# EAGLE design ExtensionV1 (EAGLE 6.1)
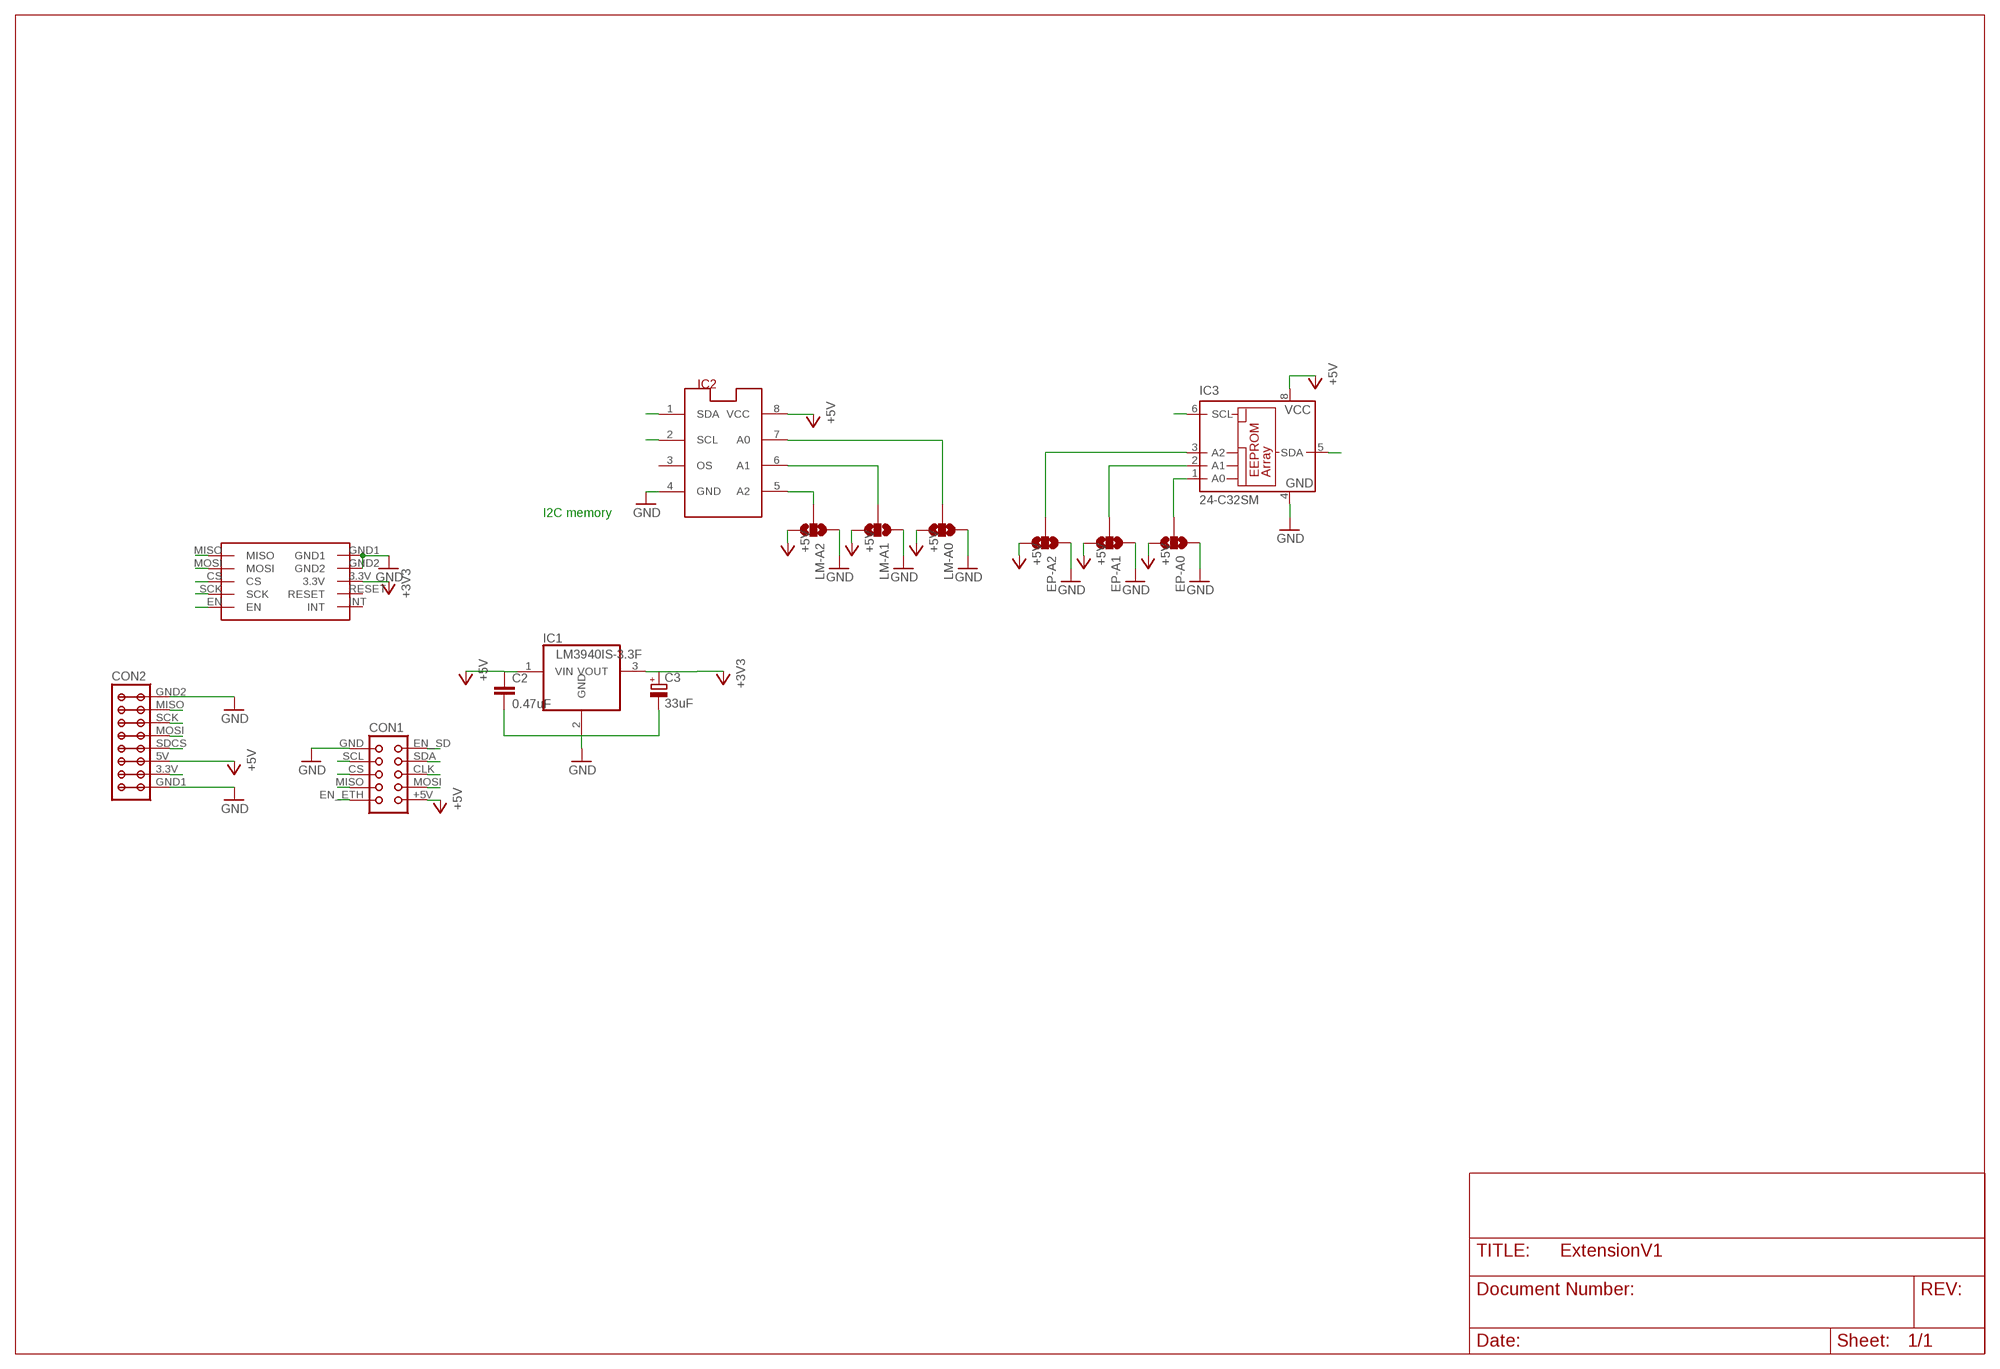
[diagram p0: schematic, sheet 1]

## Parts
C2  0.47uF  C-EUC1206  [C1206]
C3  33uF  CPOL-EUE3.5-8  [E3,5-8]
CON1  CON10EXT  [CON10EXT]
CON2  SD-CARD-EXTENSION  [SD-CARD]
EP-A0  SOLDERJUMPER_2WAY  [1206-SWITCH]
EP-A1  SOLDERJUMPER_2WAY  [1206-SWITCH]
EP-A2  SOLDERJUMPER_2WAY  [1206-SWITCH]
IC1  LM3940IS-3.3F  [DD-3]
IC2  LM75_ICN  [SO8_LM75]
IC3  24-C32SM  [SO-08M]
LM-A0  SOLDERJUMPER_2WAY  [1206-SWITCH]
LM-A1  SOLDERJUMPER_2WAY  [1206-SWITCH]
LM-A2  SOLDERJUMPER_2WAY  [1206-SWITCH]
U$1  W5100  [W5100]

## Nets
+3V3: C3.+ IC1.3(VOUT) U$1.3.3V
+5V: C2.1 CON1.+5V CON2.5V EP-A0.3 EP-A1.3 EP-A2.3 IC1.1(VIN) IC2.8(VCC) IC3.8(VCC) LM-A0.3 LM-A1.3 LM-A2.3
CLK: CON1.CLK CON2.SCK U$1.SCK
CS: U$1.CS
EN_ETH: CON1.EN_ETH U$1.EN
EN_SD: CON1.EN_SD CON2.SDCS
GND: C2.2 C3.- CON1.GND CON2.GND1 CON2.GND2 EP-A0.1 EP-A1.1 EP-A2.1 IC1.2(GND) IC2.4(GND) IC3.4(GND) LM-A0.1 LM-A1.1 LM-A2.1 U$1.GND1 U$1.GND2
MISO: CON2.MISO U$1.MISO
MOSI: CON1.MOSI CON2.MOSI U$1.MOSI
MSIO: CON1.MISO
N$1: IC2.7(A0) LM-A0.2
N$2: IC2.6(A1) LM-A1.2
N$3: IC2.5(A2) LM-A2.2
N$4: EP-A0.2 IC3.1(A0)
N$5: CON1.CS
N$6: EP-A1.2 IC3.2(A1)
N$7: EP-A2.2 IC3.3(A2)
N$14: CON2.3.3V
SCL: CON1.SCL IC2.2(SCL) IC3.6(SCL)
SDA: CON1.SDA IC2.1(SDA) IC3.5(SDA)
Unconnected: IC2.3(OS) U$1.INT U$1.RESET

## Notes on the sheet
- I2C memory

## Library data of the parts
C2 = rcl:C-EU: CAPACITOR, European symbol
C3 = rcl:CPOL-EU: POLARIZED CAPACITOR, European symbol
CON1 = lpatiny:CON10: CONNECTOR; OC_FARNELL: unknown; OC_NEWARK: unknown
CON2 = lpatiny:SD-CARD-EXTENSION: CONNECTOR; OC_FARNELL: unknown; OC_NEWARK: unknown
EP-A0 EP-A1 EP-A2 LM-A0 LM-A1 LM-A2 = lpatiny:SOLDERJUMPER_2WAY: Solder Jumper 2 way solder jumper
IC1 = lpatiny:LM3940IS-3.3: 1A Low Dropout (LDO) for 5V to 3.3V conversion; MF: TEXAS INSTRUMENTS; MPN: REG1117FAKTTT; OC_FARNELL: 1296120; OC_NEWARK: 87H2562
IC2 = lm75:LM75_IC: Temperatursensor
IC3 = microchip:24-*: Serial EEPROM 32 K/64 K, 1.8 V, I2C; MPN: M24C32-WMN6P; OC_FARNELL: 1362654; OC_NEWARK: 56P9110
U$1 = lpatiny:W5100

## Net classes
0 default: width 0.457 mm
1 power: width 0.914 mm
2 highpower: width 1.372 mm

## Board
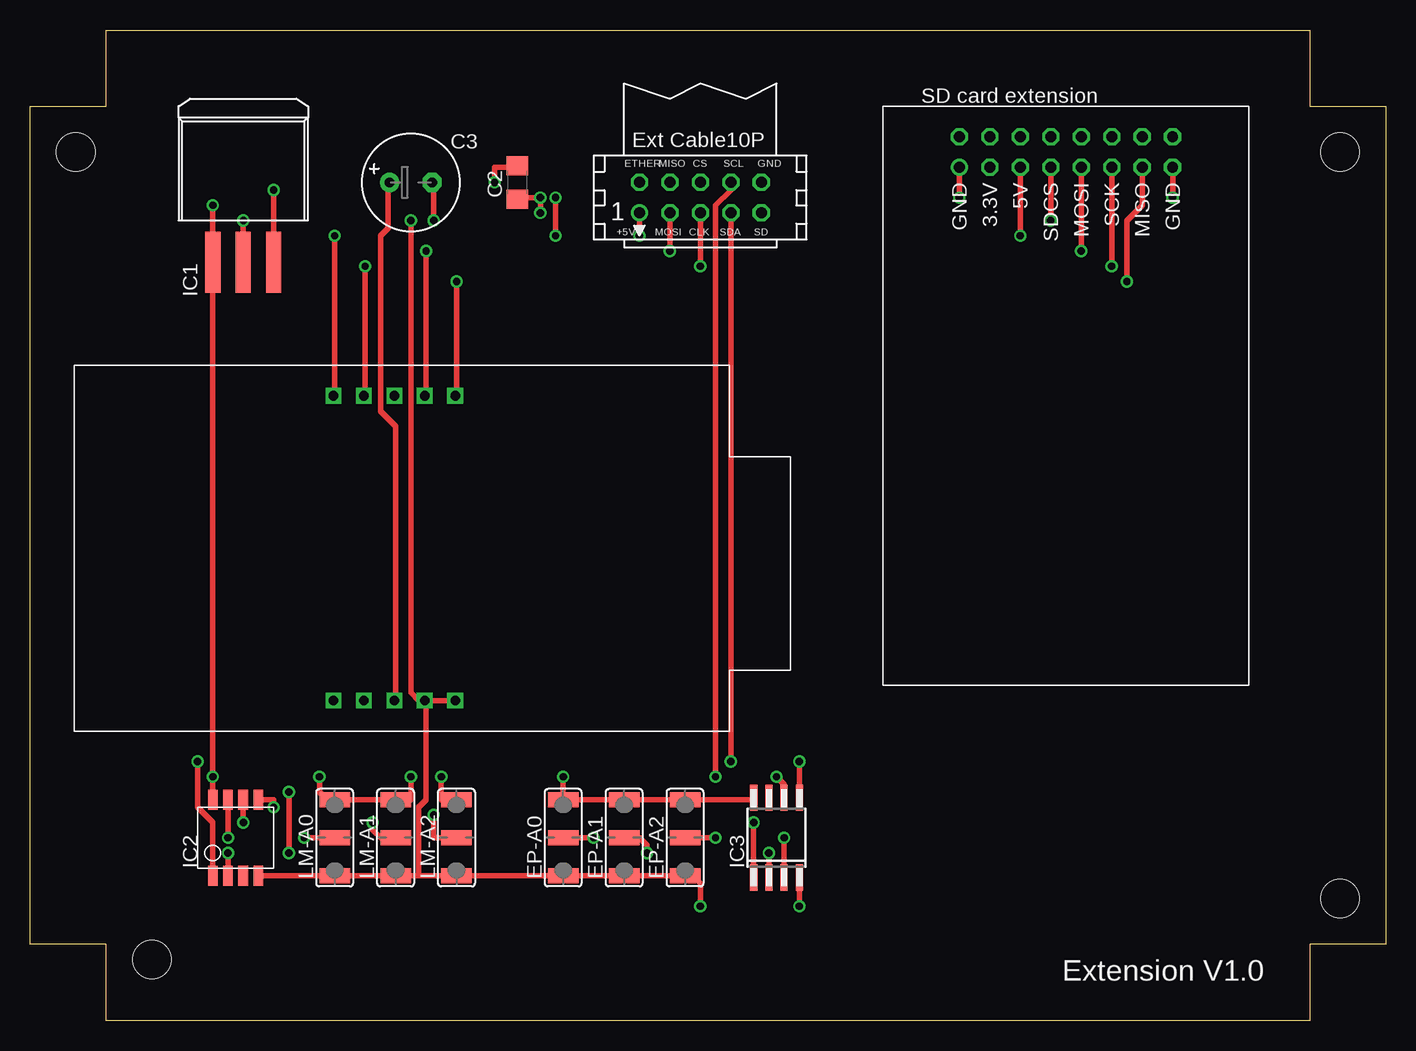
[diagram p1: board, top side]
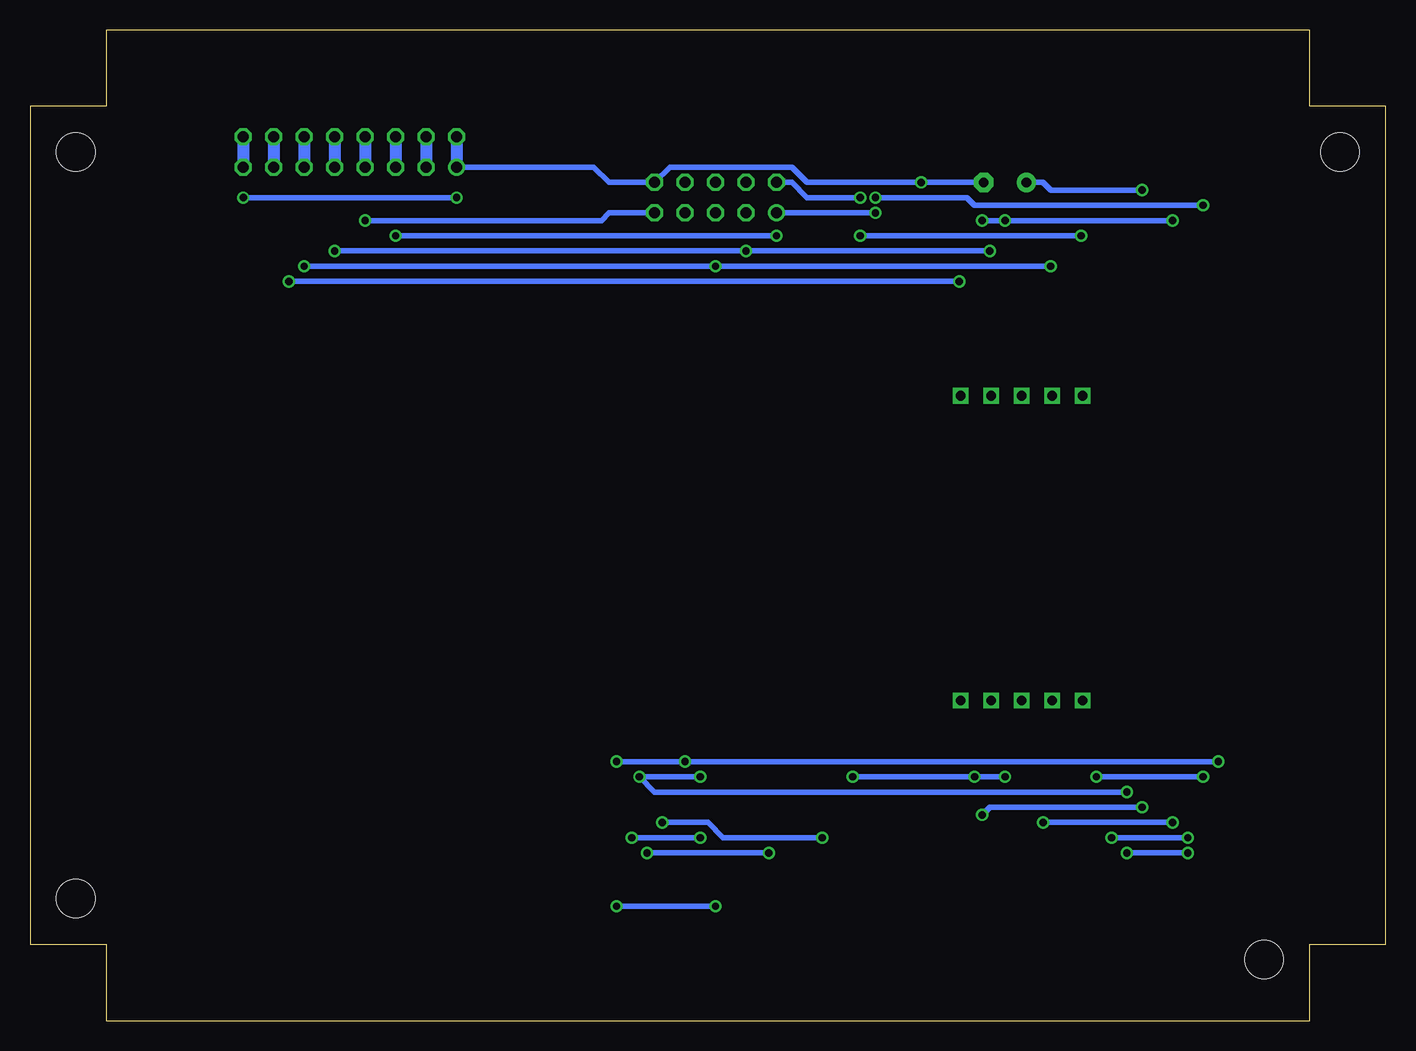
[diagram p2: board, bottom side, seen from below]

Size 113.03 x 82.55 mm. Coordinates in mm from the lower left corner, seen from the top.
Outline: 6.35,82.55 106.68,82.55 106.68,76.2 113.03,76.2 113.03,6.35 106.68,6.35 106.68,0 6.35,0 6.35,6.35 0,6.35 0,76.2 6.35,76.2 6.35,82.55
Copper layers (1*16): Top 0.035mm / dielectric 1.5mm / Bottom 0.035mm
Design rules: minimum track width 10mil, minimum drill 24mil, track to track 8mil, track to pad 8mil, pad to pad 8mil, via to via 8mil, smd to smd 8mil, copper to edge 40mil, drill to drill 8mil, minimum pad ring 10mil, minimum via ring 8mil, stop-mask expansion 4mil, vias tented up to drill 0mil, thermal gap 10mil
Holes 3.2 mm at 3.81,72.39 10.16,5.08 109.22,10.16 109.22,72.39
Milling: 12 lines

### Footprints (pad centres in the part's own frame; a part is rotated, then mirrored left to right if it is on the bottom)
C1206 = smd 1.6 x 1.8: 1 -1.4,0; 2 1.4,0
E3,5-8 = drill 0.813 pad 1.6: + -1.778,0 | drill 0.813 pad 1.6 octagon: - 1.778,0
CON10EXT = drill 0.914: +5V -5.08,-1.27 | drill 0.914 octagon: CLK 0,-1.27; CS 0,1.27; EN_ETH -5.08,1.27; EN_SD 5.08,-1.27; GND 5.08,1.27; MISO -2.54,1.27; MOSI -2.54,-1.27; SCL 2.54,1.27; SDA 2.54,-1.27
SD-CARD = drill 0.914 octagon: 2 2.54,6.35; 3.3V 5.08,8.89; 4 2.54,8.89; 5V 5.08,11.43; 6 2.54,11.43; 8 2.54,13.97; 10 2.54,16.51; 12 2.54,19.05; 14 2.54,21.59; 16 2.54,24.13; GND2 5.08,24.13; MISO 5.08,21.59; MOSI 5.08,16.51; SCK 5.08,19.05; SDCS 5.08,13.97 | drill 0.914: GND1 5.08,6.35
1206-SWITCH = smd 1.27 x 2.54: 1 -3.175,0; 2 0,0; 3 3.175,0
DD-3 = smd 1.27 x 5.08: 1 -2.54,-7.938; 2 0,-7.938; 3 2.54,-7.938
SO8_LM75 = smd 0.813 x 1.676: 1 -1.27,-3.175; 2 0,-3.175; 3 1.27,-3.175; 4 2.54,-3.175; 5 2.54,3.175; 6 1.27,3.175; 7 0,3.175; 8 -1.27,3.175
SO-08M = smd 0.6 x 2.2: 1 -1.905,-3.33; 2 -0.635,-3.33; 3 0.635,-3.33; 4 1.905,-3.33; 5 1.905,3.33; 6 0.635,3.33; 7 -0.635,3.33; 8 -1.905,3.33
W5100 = drill 0.8 square: 3.3V 0,-12.7; CS 0,12.7; EN -5.08,12.7; GND1 5.08,-12.7; GND2 2.54,-12.7; INT -5.08,-12.7; MISO 5.08,12.7; MOSI 2.54,12.7; RESET -2.54,-12.7; SCK -2.54,12.7

### Placement (x,y rotation side)
C2  40.64,69.85 90 top
C3  31.75,69.85 0 top
CON1  55.88,68.58 0 top
CON2  71.12,76.2 270 top
EP-A0  44.45,15.24 90 top
EP-A1  49.53,15.24 90 top
EP-A2  54.61,15.24 90 top
IC1  17.78,71.12 0 top
IC2  16.51,15.24 0 top
IC3  62.23,15.24 0 top
LM-A0  25.4,15.24 90 top
LM-A1  30.48,15.24 90 top
LM-A2  35.56,15.24 90 top
U$1  30.36,39.37 0 top

### Tracks (layer width: path | path; a pad name or v marks a point on that pad's centre or on a via)
+3V3  (via drill 0.61)
  Top 0.457: U$1.3.3V 30.48,26.67 30.48,49.53 29.21,50.8 29.21,65.41 29.84,66.04 29.84,69.85 C3.+ | v20.32,69.22 IC1.3
  Bottom 0.457: v20.32,69.22 27.94,69.22 28.57,69.85 C3.+
+5V  (via drill 0.61)
  Top 0.457: IC3.8 60.33,18.41 EP-A2.3 EP-A1.3 EP-A0.3 v44.45,20.32 | IC2.8 v15.24,20.32 IC1.1 v15.24,67.94 | v24.13,20.32 24.13,19.05 24.77,18.41 LM-A0.3 LM-A1.3 31.75,18.41 v31.75,20.32 | LM-A2.3 34.29,18.41 v34.29,20.32 | v42.55,67.31 v42.55,68.58 40.64,68.58 C2.1 | v82.55,65.41 CON2.5V | CON1.+5V v50.8,65.41
  Bottom 0.457: v24.13,20.32 v15.24,20.32 | v31.75,20.32 v34.29,20.32 v44.45,20.32 | CON1.+5V v42.55,67.31 | v50.8,65.41 v82.55,65.41 | v15.24,67.94 34.29,67.94 34.93,68.58 v42.55,68.58
CLK  (via drill 0.61)
  Top 0.457: v27.94,62.87 27.94,52.07 U$1.SCK | CON1.CLK v55.88,62.87 | v90.17,62.87 CON2.SCK
  Bottom 0.457: v27.94,62.87 v55.88,62.87 v90.17,62.87
EN_ETH  (via drill 0.61)
  Top 0.457: v25.4,65.41 25.4,52.07 U$1.EN | v43.82,68.58 v43.82,65.41
  Bottom 0.457: v43.82,65.41 v25.4,65.41 | v43.82,68.58 48.26,68.58 49.53,69.85 CON1.EN_ETH
EN_SD  (via drill 0.61)
  Top 0.457: CON2.SDCS v85.09,66.67
  Bottom 0.457: CON1.EN_SD 64.77,67.31 65.41,66.67 v85.09,66.67
GND  (via drill 0.61)
  Top 0.457: v64.14,9.53 IC3.4 | v55.88,9.53 55.88,11.43 55.25,12.06 EP-A2.1 EP-A1.1 EP-A0.1 LM-A2.1 32.38,12.06 | 33.02,26.67 U$1.GND1 | IC2.4 LM-A0.1 LM-A1.1 32.38,12.06 | 33.02,26.67 33.02,18.41 32.38,17.78 32.38,12.06 | 33.02,26.67 U$1.GND2 32.38,26.67 31.75,27.3 v31.75,66.67 | v38.74,69.85 38.74,71.12 40.64,71.12 C2.2 | v95.25,68.58 CON2.GND2 | CON2.GND1 v77.47,68.58 | v17.78,66.67 IC1.2 | v33.66,66.67 33.66,69.85 C3.-
  Bottom 0.457: v55.88,9.53 v64.14,9.53 | C3.- v38.74,69.85 48.26,69.85 49.53,71.12 59.69,71.12 CON1.GND 64.77,69.85 66.04,71.12 CON2.GND1 | v77.47,68.58 v95.25,68.58 | v33.66,66.67 v31.75,66.67 v17.78,66.67
MISO  (via drill 0.61)
  Top 0.457: v35.56,61.59 35.56,52.07 U$1.MISO | v91.44,61.59 91.44,66.67 92.71,67.94 CON2.MISO
  Bottom 0.457: v91.44,61.59 v35.56,61.59
MOSI  (via drill 0.61)
  Top 0.457: v33.02,64.14 33.02,52.07 U$1.MOSI | CON1.MOSI v53.34,64.14 | v87.63,64.14 CON2.MOSI
  Bottom 0.457: v33.02,64.14 v53.34,64.14 v87.63,64.14
N$1  (via drill 0.61)
  Top 0.457: v16.51,15.24 IC2.7 | LM-A0.2 v22.86,15.24
  Bottom 0.457: v22.86,15.24 v16.51,15.24
N$2  (via drill 0.61)
  Top 0.457: v17.78,16.51 IC2.6 | v28.57,16.51 28.57,15.88 29.21,15.24 LM-A1.2
  Bottom 0.457: v28.57,16.51 v17.78,16.51
N$3  (via drill 0.61)
  Top 0.457: IC2.5 20.32,18.41 v20.32,17.78 | v33.66,17.14 33.66,15.24 LM-A2.2
  Bottom 0.457: v20.32,17.78 33.02,17.78 v33.66,17.14
N$4  (via drill 0.61)
  Top 0.457: v60.33,16.51 IC3.1 | EP-A0.2 v46.99,15.24
  Bottom 0.457: v60.33,16.51 56.52,16.51 55.25,15.24 v46.99,15.24
N$6  (via drill 0.61)
  Top 0.457: v61.6,13.97 IC3.2 | v51.44,13.97 51.44,14.61 50.8,15.24 EP-A1.2
  Bottom 0.457: v51.44,13.97 v61.6,13.97
N$7  (via drill 0.61)
  Top 0.457: v62.87,15.24 IC3.3 | EP-A2.2 v57.15,15.24
  Bottom 0.457: v57.15,15.24 v62.87,15.24
SCL  (via drill 0.61)
  Top 0.457: v16.51,13.97 IC2.2 | v21.59,19.05 v21.59,13.97 | v62.23,20.32 62.87,19.68 IC3.6 | CON1.SCL 58.42,69.22 57.15,67.94 v57.15,20.32
  Bottom 0.457: v21.59,13.97 v16.51,13.97 | v21.59,19.05 60.96,19.05 v62.23,20.32 v57.15,20.32
SDA  (via drill 0.61)
  Top 0.457: IC2.1 15.24,16.51 13.97,17.78 v13.97,21.59 | IC3.5 v64.14,21.59 | v58.42,21.59 CON1.SDA
  Bottom 0.457: v64.14,21.59 v58.42,21.59 v13.97,21.59

### Text on the board
tPlace: Extension V1.0